# EAGLE design FINAL (EAGLE 9.6.2)
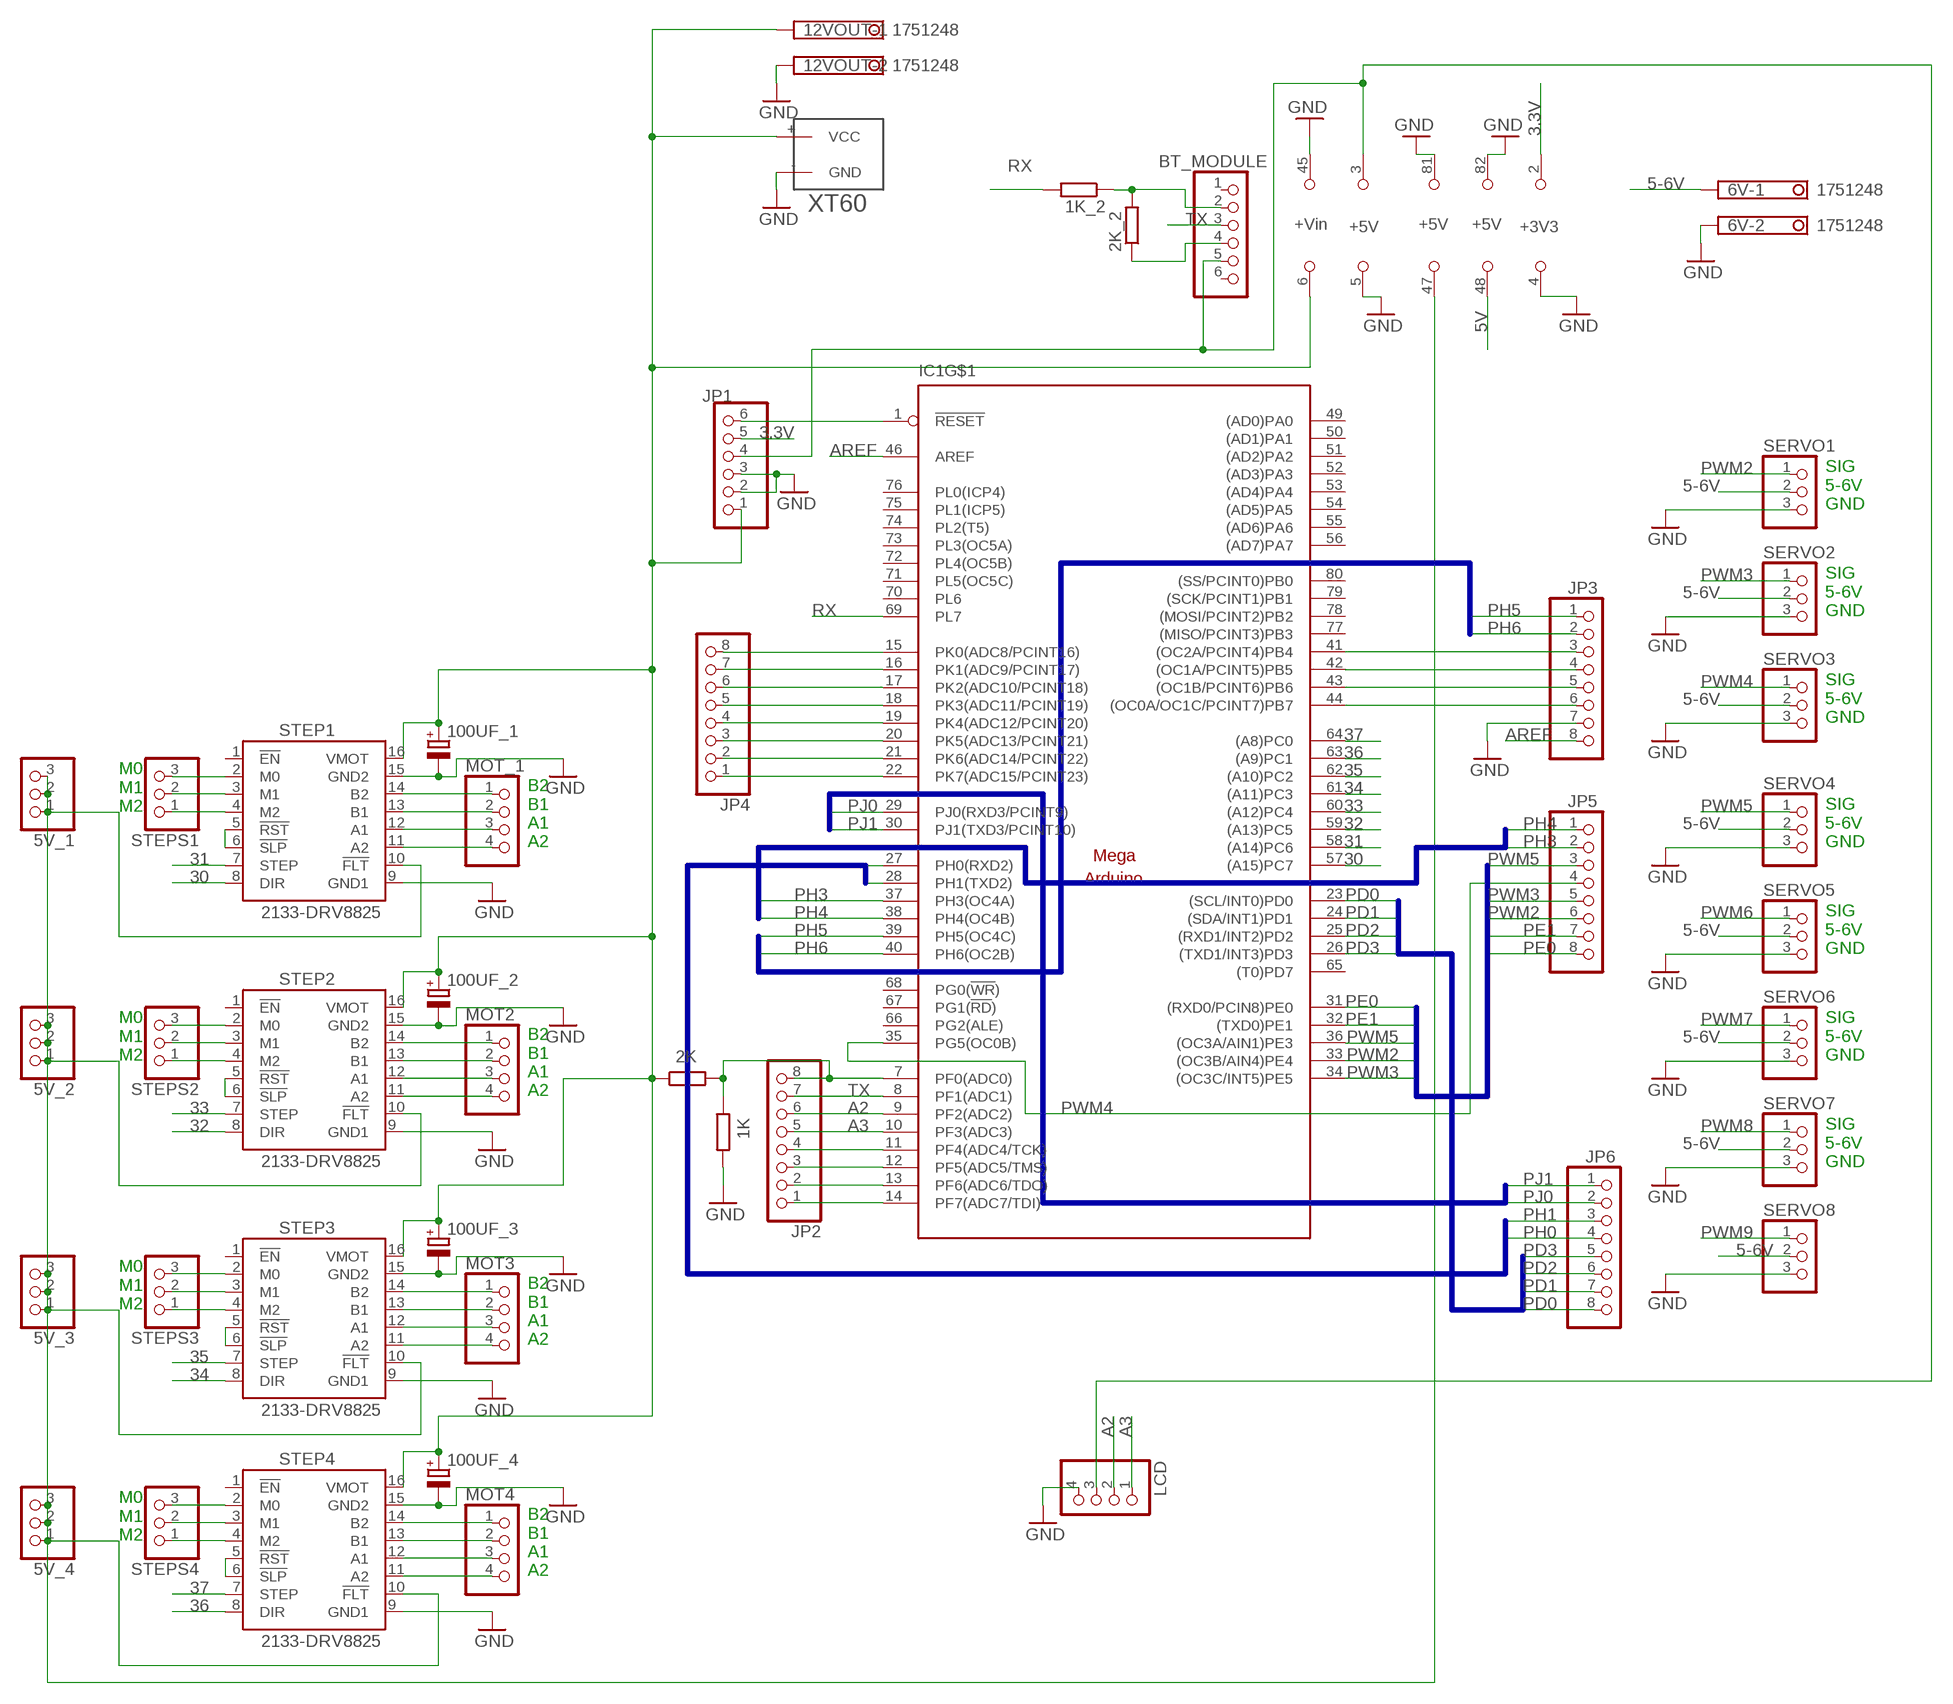
[diagram p0: schematic, sheet 1]

## Parts
1K  R-EU_0204/7  [0204/7]
1K_2  R-EU_0204/7  [0204/7]
2K  R-EU_0204/7  [0204/7]
2K_2  R-EU_0204/7  [0204/7]
5V_1  PINHD-1X3  [1X03]
5V_2  PINHD-1X3  [1X03]
5V_3  PINHD-1X3  [1X03]
5V_4  PINHD-1X3  [1X03]
6V  1751248  [1751248]
12VOUT  1751248  [1751248]
100UF_1  CPOL-EUE5-5  [E5-5]
100UF_2  CPOL-EUE5-5  [E5-5]
100UF_3  CPOL-EUE5-5  [E5-5]
100UF_4  CPOL-EUE5-5  [E5-5]
BT_MODULE  PINHD-1X6  [1X06]
IC1  MEGAARDUINO_22  [MEGA_ARDUINO_2]
JP1  PINHD-1X6  [1X06]
JP2  PINHD-1X8  [1X08]
JP3  PINHD-1X8  [1X08]
JP4  PINHD-1X8  [1X08]
JP5  PINHD-1X8  [1X08]
JP6  PINHD-1X8  [1X08]
LCD  PINHD-1X4  [1X04]
MOT2  PINHD-1X4  [1X04]
MOT3  PINHD-1X4  [1X04]
MOT4  PINHD-1X4  [1X04]
MOT_1  PINHD-1X4  [1X04]
SERVO1  PINHD-1X3  [1X03]
SERVO2  PINHD-1X3  [1X03]
SERVO3  PINHD-1X3  [1X03]
SERVO4  PINHD-1X3  [1X03]
SERVO5  PINHD-1X3  [1X03]
SERVO6  PINHD-1X3  [1X03]
SERVO7  PINHD-1X3  [1X03]
SERVO8  PINHD-1X3  [1X03]
STEP1  2133-DRV8825  [DRV8825]
STEP2  2133-DRV8825  [DRV8825]
STEP3  2133-DRV8825  [DRV8825]
STEP4  2133-DRV8825  [DRV8825]
STEPS1  PINHD-1X3  [1X03]
STEPS2  PINHD-1X3  [1X03]
STEPS3  PINHD-1X3  [1X03]
STEPS4  PINHD-1X3  [1X03]
U$1  XT60  [XT60]

## Nets
3.3V [ALL]: IC1.2(+3V3) JP1.5
5-6V [ALL]: 6V.1 SERVO1.2 SERVO2.2 SERVO3.2 SERVO4.2 SERVO5.2 SERVO6.2 SERVO7.2 SERVO8.2
5V [ALL]: IC1.48(+5V)
12V1 [12V]: 2K.1 12VOUT.1 100UF_1.+ 100UF_2.+ 100UF_3.+ 100UF_4.+ IC1.6(+VIN) JP1.1 STEP1.16(VMOT) STEP2.16(VMOT) STEP3.16(VMOT) STEP4.16(VMOT) U$1.+(VCC)
30 [ALL]: IC1.57((A15)PC7) STEP1.8(DIR)
31 [ALL]: IC1.58((A14)PC6) STEP1.7(STEP)
32 [ALL]: IC1.59((A13)PC5) STEP2.8(DIR)
33 [ALL]: IC1.60((A12)PC4) STEP2.7(STEP)
34 [ALL]: IC1.61((A11)PC3) STEP3.8(DIR)
35 [ALL]: IC1.62((A10)PC2) STEP3.7(STEP)
36 [ALL]: IC1.63((A9)PC1) STEP4.8(DIR)
37 [ALL]: IC1.64((A8)PC0) STEP4.7(STEP)
A2 [ALL]: IC1.9(PF2(ADC2)) JP2.6 LCD.2
A3 [ALL]: IC1.10(PF3(ADC3)) JP2.5 LCD.1
AREF [ALL]: IC1.46(AREF) JP3.8
GND [ALL]: 1K.2 6V.2 12VOUT.2 100UF_1.- 100UF_2.- 100UF_3.- 100UF_4.- IC1.4(GND) IC1.5(GND) IC1.45(GND) IC1.81(GND) IC1.82(GND) JP1.2 JP1.3 JP3.7 LCD.4 SERVO1.3 SERVO2.3 SERVO3.3 SERVO4.3 SERVO5.3 SERVO6.3 SERVO7.3 SERVO8.3 STEP1.9(GND1) STEP1.15(GND2) STEP2.9(GND1) STEP2.15(GND2) STEP3.9(GND1) STEP3.15(GND2) STEP4.9(GND1) STEP4.15(GND2) U$1.-(GND)
N$1 [ALL]: IC1.11(PF4(ADC4/TCK)) JP2.4
N$2 [ALL]: MOT_1.1 STEP1.14(B2)
N$3 [ALL]: MOT_1.2 STEP1.13(B1)
N$4 [ALL]: MOT_1.3 STEP1.12(A1)
N$5 [ALL]: MOT_1.4 STEP1.11(A2)
N$6 [ALL]: MOT2.1 STEP2.14(B2)
N$7 [ALL]: MOT2.2 STEP2.13(B1)
N$8 [ALL]: MOT2.3 STEP2.12(A1)
N$9 [ALL]: MOT2.4 STEP2.11(A2)
N$10 [ALL]: MOT3.1 STEP3.14(B2)
N$11 [ALL]: MOT3.2 STEP3.13(B1)
N$12 [ALL]: MOT3.3 STEP3.12(A1)
N$13 [ALL]: MOT3.4 STEP3.11(A2)
N$14 [ALL]: MOT4.1 STEP4.14(B2)
N$15 [ALL]: MOT4.2 STEP4.13(B1)
N$16 [ALL]: MOT4.3 STEP4.12(A1)
N$17 [ALL]: MOT4.4 STEP4.11(A2)
N$18 [ALL]: STEP1.2(M0) STEPS1.3
N$19 [ALL]: 2K_2.1 BT_MODULE.4
N$20 [ALL]: 1K_2.1 2K_2.2 BT_MODULE.2
N$22 [ALL]: STEP1.3(M1) STEPS1.2
N$23 [ALL]: STEP1.4(M2) STEPS1.1
N$24 [ALL]: STEP2.2(M0) STEPS2.3
N$25 [ALL]: STEP2.3(M1) STEPS2.2
N$26 [ALL]: STEP2.4(M2) STEPS2.1
N$27 [ALL]: STEP3.2(M0) STEPS3.3
N$28 [ALL]: STEP3.3(M1) STEPS3.2
N$29 [ALL]: STEP3.4(M2) STEPS3.1
N$30 [ALL]: STEP4.2(M0) STEPS4.3
N$31 [ALL]: STEP4.3(M1) STEPS4.2
N$32 [ALL]: STEP4.4(M2) STEPS4.1
N$33 [ALL]: STEP1.5(!RST) STEP1.6(!SLP)
N$34 [ALL]: STEP2.5(!RST) STEP2.6(!SLP)
N$35 [ALL]: STEP3.5(!RST) STEP3.6(!SLP)
N$36 [ALL]: STEP4.5(!RST) STEP4.6(!SLP)
N$37 [ALL]: 5V_1.1 5V_1.2 5V_1.3 5V_2.1 5V_2.2 5V_2.3 5V_3.1 5V_3.2 5V_3.3 5V_4.1 5V_4.2 5V_4.3 IC1.47(+5V) STEP1.10(!FLT) STEP2.10(!FLT) STEP3.10(!FLT) STEP4.10(!FLT)
N$38 [ALL]: IC1.1(!RESET) JP1.6
N$39 [ALL]: 1K.1 2K.2 IC1.7(PF0(ADC0)) JP2.8
N$40 [ALL]: IC1.12(PF5(ADC5/TMS)) JP2.3
N$41 [ALL]: IC1.13(PF6(ADC6/TDO)) JP2.2
N$42 [ALL]: IC1.14(PF7(ADC7/TDI)) JP2.1
N$43 [ALL]: IC1.15(PK0(ADC8/PCINT16)) JP4.8
N$44 [ALL]: IC1.16(PK1(ADC9/PCINT17)) JP4.7
N$45 [ALL]: IC1.17(PK2(ADC10/PCINT18)) JP4.6
N$46 [ALL]: IC1.18(PK3(ADC11/PCINT19)) JP4.5
N$47 [ALL]: IC1.19(PK4(ADC12/PCINT20)) JP4.4
N$48 [ALL]: IC1.20(PK5(ADC13/PCINT21)) JP4.3
N$49 [ALL]: IC1.21(PK6(ADC14/PCINT22)) JP4.2
N$50 [ALL]: IC1.22(PK7(ADC15/PCINT23)) JP4.1
N$51 [ALL]: IC1.44((OC0A/OC1C/PCINT7)PB7) JP3.6
N$52 [ALL]: IC1.43((OC1B/PCINT6)PB6) JP3.5
N$53 [ALL]: IC1.42((OC1A/PCINT5)PB5) JP3.4
N$54 [ALL]: IC1.41((OC2A/PCINT4)PB4) JP3.3
N$55 [ALL]: BT_MODULE.5 IC1.3(+5V) JP1.4 LCD.3
PD0 [ALL]: IC1.23((SCL/INT0)PD0) JP6.8
PD1 [ALL]: IC1.24((SDA/INT1)PD1) JP6.7
PD2 [ALL]: IC1.25((RXD1/INT2)PD2) JP6.6
PD3 [ALL]: IC1.26((TXD1/INT3)PD3) JP6.5
PE0 [ALL]: IC1.31((RXD0/PCIN8)PE0) JP5.8
PE1 [ALL]: IC1.32((TXD0)PE1) JP5.7
PH0 [ALL]: IC1.27(PH0(RXD2)) JP6.4
PH1 [ALL]: IC1.28(PH1(TXD2)) JP6.3
PH3 [ALL]: IC1.37(PH3(OC4A)) JP5.2
PH4 [ALL]: IC1.38(PH4(OC4B)) JP5.1
PH5 [ALL]: IC1.39(PH5(OC4C)) JP3.1
PH6 [ALL]: IC1.40(PH6(OC2B)) JP3.2
PJ0 [ALL]: IC1.29(PJ0(RXD3/PCINT9)) JP6.2
PJ1 [ALL]: IC1.30(PJ1(TXD3/PCINT10)) JP6.1
PWM2 [ALL]: IC1.33((OC3B/AIN4)PE4) JP5.6 SERVO1.1
PWM3 [ALL]: IC1.34((OC3C/INT5)PE5) JP5.5 SERVO2.1
PWM4 [ALL]: IC1.35(PG5(OC0B)) JP5.4 SERVO3.1
PWM5 [ALL]: IC1.36((OC3A/AIN1)PE3) JP5.3 SERVO4.1
PWM6 [ALL]: SERVO5.1
PWM7 [ALL]: SERVO6.1
PWM8 [ALL]: SERVO7.1
PWM9 [ALL]: SERVO8.1
RX [ALL]: 1K_2.2 IC1.69(PL7)
TX [ALL]: BT_MODULE.3 IC1.8(PF1(ADC1)) JP2.7
Unconnected: BT_MODULE.1 BT_MODULE.6 IC1.49((AD0)PA0) IC1.50((AD1)PA1) IC1.51((AD2)PA2) IC1.52((AD3)PA3) IC1.53((AD4)PA4) IC1.54((AD5)PA5) IC1.55((AD6)PA6) IC1.56((AD7)PA7) IC1.65((T0)PD7) IC1.66(PG2(ALE)) IC1.67(PG1(!RD!)) IC1.68(PG0(!WR!)) IC1.70(PL6) IC1.71(PL5(OC5C)) IC1.72(PL4(OC5B)) IC1.73(PL3(OC5A)) IC1.74(PL2(T5)) IC1.75(PL1(ICP5)) IC1.76(PL0(ICP4)) IC1.77((MISO/PCINT3)PB3) IC1.78((MOSI/PCINT2)PB2) IC1.79((SCK/PCINT1)PB1) IC1.80((SS/PCINT0)PB0) STEP1.1(!EN) STEP2.1(!EN) STEP3.1(!EN) STEP4.1(!EN)

## Buses
PH5,PH6
PH3,PH4
PE0,PE1,PWM2,PWM3,PWM5
PJ0,PJ1
PH0,PH1
PD0,PD1,PD2,PD3

## Notes on the sheet
- SIG
  5-6V
  GND
- SIG
  5-6V
  GND
- SIG
  5-6V
  GND
- M0
  M1
  M2
- B2
  B1
  A1
  A2
- SIG
  5-6V
  GND
- SIG
  5-6V
  GND
- M0
  M1
  M2
- SIG
  5-6V
  GND
- B2
  B1
  A1
  A2
- SIG
  5-6V
  GND
- M0
  M1
  M2
- B2
  B1
  A1
  A2
- M0
  M1
  M2
- B2
  B1
  A1
  A2

## Library data of the parts
1K 1K_2 2K 2K_2 = rcl:R-EU_: RESISTOR, European symbol; SPICEPREFIX: R
5V_1-5V_4 SERVO1-SERVO8 STEPS1-STEPS4 = pinhead:PINHD-1X3: PIN HEADER
6V 12VOUT = con-phoenix-350:1751248: MKDS 1/ 2-3,5 Printklemme Nennstrom: 10 A Bemessungsspannung: 160 V Raster: 3,5 mm Polzahl: 2 Montageart: Löten Anschlussart: Schraubanschluss Anschlussrichtung vom Leiter zur Platine: 0° Source: http://eshop.phoenixcontact.com .. 1751248.pdf; OC_FARNELL: unknown; OC_NEWARK: unknown
100UF_1-100UF_4 = rcl:CPOL-EU: POLARIZED CAPACITOR, European symbol; SPICEPREFIX: C
BT_MODULE JP1 = pinhead:PINHD-1X6: PIN HEADER
IC1 = arduino:MEGAARDUINO_2: The Arduino Mega is a microcontroller board based on the ATmega1280. - 54 digital input/output pins (of which 14 can be used as PWM outputs) - 16 analog inputs - 4 UARTs (hardware serial ports) - 16 MHz crystal oscillator - USB connection - power jack - ICSP header - reset button It contains everything needed to support the microcontroller; simply connect it to a computer with a USB cable or power it with a AC-to-DC adapter or battery to get started. The Mega is compatible with most shields designed for the Arduino Duemilanove or Diecimila. http://arduino.cc/en/Main/ArduinoBoardMega
JP2-JP6 = pinhead:PINHD-1X8: PIN HEADER
LCD MOT2-MOT4 MOT_1 = pinhead:PINHD-1X4: PIN HEADER
STEP1-STEP4 = pololu-stepper-driver:2133-DRV8825: DRV8825 Stepper Motor Driver Carrier, High Current #2133 DRV8825 Stepper Motor Driver Carrier; High Current <https://www.pololu.com/product/2133> in Japan, Suzaku Lab. Ltd. <https://suzakugiken.jp/> #2133 DRV8825 大電流用ステッピングモータドライバ <https://szc.jp/po2133>
U$1 = XT60:XT60: XT60

## Net classes
1 12V: width 1.27 mm, clearance 0.127 mm
2 ALL: width 0.508 mm, clearance 0.127 mm

## Board
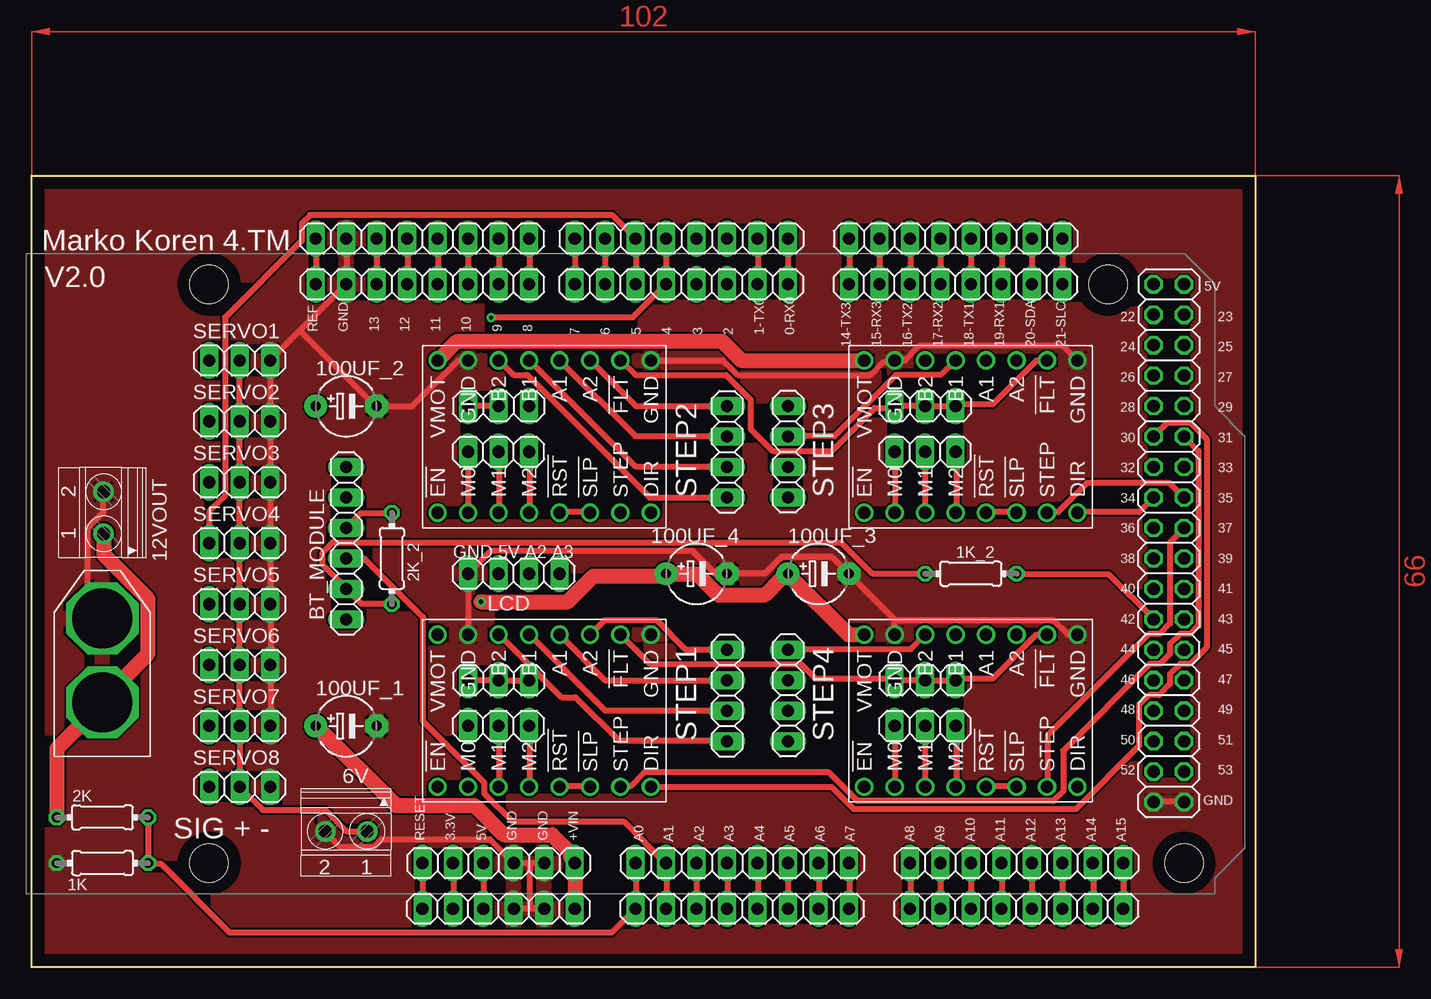
[diagram p1: board, top side]
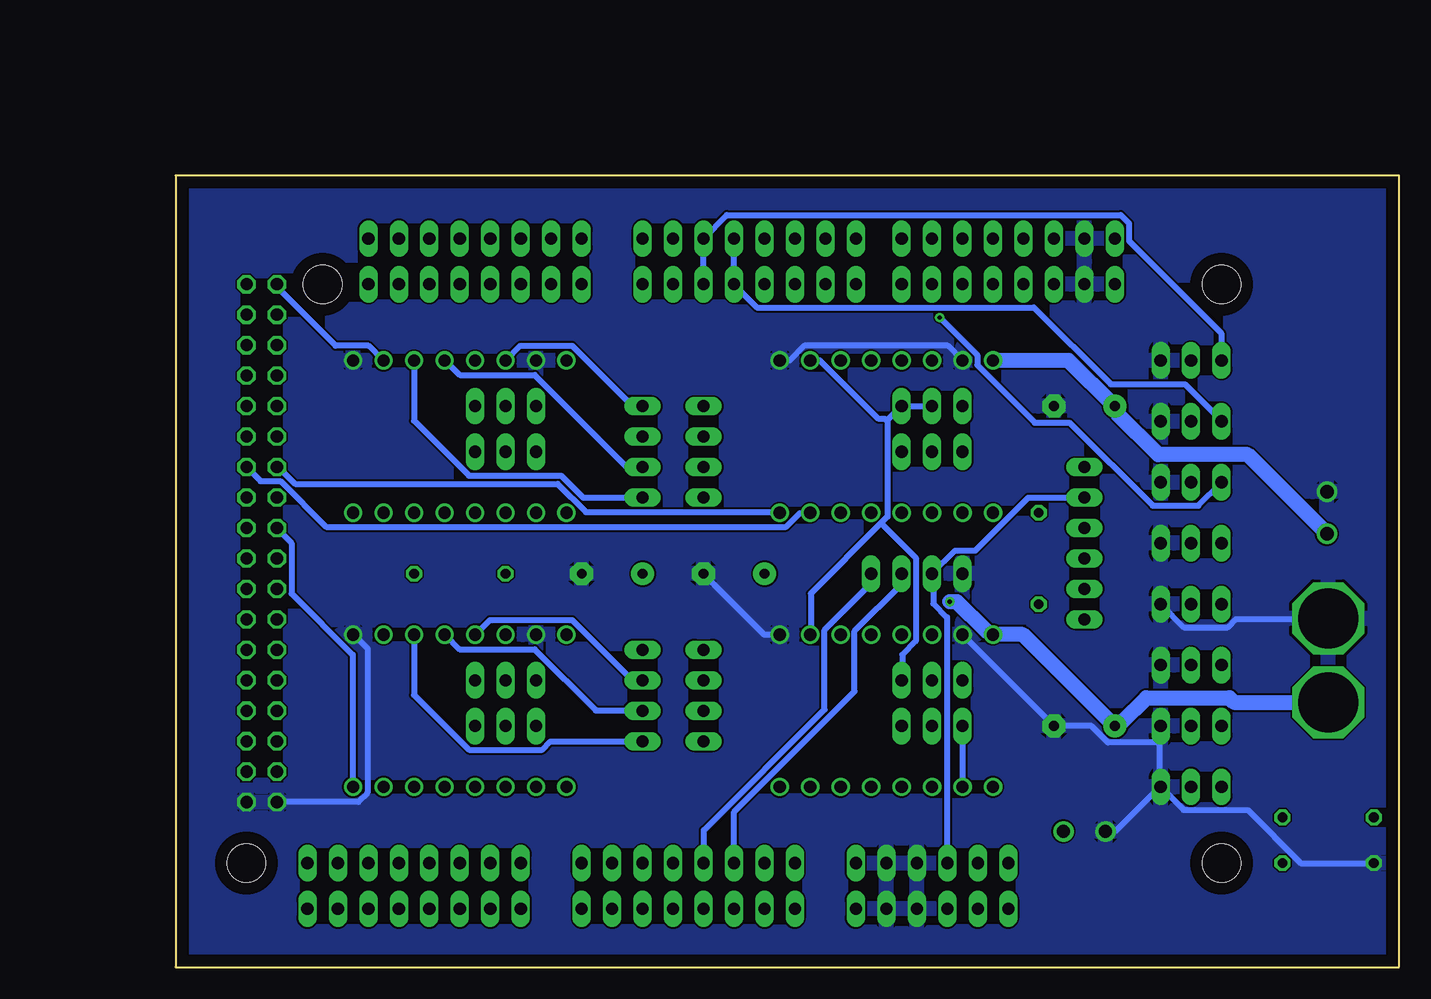
[diagram p2: board, bottom side, seen from below]

Size 102 x 66 mm. Coordinates in mm from the lower left corner, seen from the top.
Outline: 0,66 102,66 102,0 0,0 0,66
Copper layers (1*16): Top 0.035mm / dielectric 1.5mm / Bottom 0.035mm
Design rules "default": minimum track width 6mil, minimum drill 0.35mm, track to track 6mil, track to pad 6mil, pad to pad 6mil, via to via 6mil, smd to smd 6mil, copper to edge 40mil, drill to drill 6mil, minimum pad ring 10mil, minimum via ring 8mil, stop-mask expansion 4mil, vias tented up to drill 0mil, thermal gap 10mil

### Footprints (pad centres in the part's own frame; a part is rotated, then mirrored left to right if it is on the bottom)
0204/7 = drill 0.813 octagon: 1 -3.81,0; 2 3.81,0
1X03 = drill 1.016 long: 1 -2.54,0; 2 0,0; 3 2.54,0
1751248 = drill 1.1 pad 1.7: 1 -1.75,-0.1; 2 1.75,-0.1
E5-5 = drill 0.813 pad 1.905: + -2.54,0 | drill 0.813 pad 1.905 octagon: - 2.54,0
1X06 = drill 1.016 long: 1 -6.35,0; 2 -3.81,0; 3 -1.27,0; 4 1.27,0; 5 3.81,0; 6 6.35,0
MEGA_ARDUINO_2 = drill 1.016 long: 1 33.02,2.54; 2 35.56,2.54; 3 38.1,2.54; 4 40.64,2.54; 5 43.18,2.54; 6 45.72,2.54; 7 50.8,2.54; 8 53.34,2.54; 9 55.88,2.54; 10 58.42,2.54; 11 60.96,2.54; 12 63.5,2.54; 13 66.04,2.54; 14 68.58,2.54; 15 73.66,2.54; 16 76.2,2.54; 17 78.74,2.54; 18 81.28,2.54; 19 83.82,2.54; 20 86.36,2.54; 21 88.9,2.54; 22 91.44,2.54; 23 86.36,50.8; 24 83.82,50.8; 25 81.28,50.8; 26 78.74,50.8; 27 76.2,50.8; 28 73.66,50.8; 29 71.12,50.8; 30 68.58,50.8; 31 63.5,50.8; 32 60.96,50.8; 33 58.42,50.8; 34 55.88,50.8; 35 53.34,50.8; 36 50.8,50.8; 37 48.26,50.8; 38 45.72,50.8; 39 41.91,50.8; 40 39.37,50.8; 41 36.83,50.8; 42 34.29,50.8; 43 31.75,50.8; 44 29.21,50.8; 45 26.67,50.8; 46 24.13,50.8 | drill 1.016 octagon: 47 93.98,50.8; 48 96.52,50.8; 49 93.98,48.26; 50 96.52,48.26; 51 93.98,45.72; 52 96.52,45.72; 53 93.98,43.18; 54 96.52,43.18; 55 93.98,40.64; 56 96.52,40.64; 57 93.98,38.1; 58 96.52,38.1; 59 93.98,35.56; 60 96.52,35.56; 61 93.98,33.02; 62 96.52,33.02; 63 93.98,30.48; 64 96.52,30.48; 65 93.98,27.94; 66 96.52,27.94; 67 93.98,25.4; 68 96.52,25.4; 69 93.98,22.86; 70 96.52,22.86; 71 93.98,20.32; 72 96.52,20.32; 73 93.98,17.78; 74 96.52,17.78; 75 93.98,15.24; 76 96.52,15.24; 77 93.98,12.7; 78 96.52,12.7; 79 93.98,10.16; 80 96.52,10.16; 81 93.98,7.62; 82 96.52,7.62 | hole 3.2: 15.24,50.8; 15.24,2.54; 90.17,50.8; 96.52,2.54
1X08 = drill 1.016 long: 1 -8.89,0; 2 -6.35,0; 3 -3.81,0; 4 -1.27,0; 5 1.27,0; 6 3.81,0; 7 6.35,0; 8 8.89,0
1X04 = drill 1.016 long: 1 -3.81,0; 2 -1.27,0; 3 1.27,0; 4 3.81,0
DRV8825 = drill 1.016: 1 -6.35,8.89; 2 -6.35,6.35; 3 -6.35,3.81; 4 -6.35,1.27; 5 -6.35,-1.27; 6 -6.35,-3.81; 7 -6.35,-6.35; 8 -6.35,-8.89; 9 6.35,-8.89; 10 6.35,-6.35; 11 6.35,-3.81; 12 6.35,-1.27; 13 6.35,1.27; 14 6.35,3.81; 15 6.35,6.35; 16 6.35,8.89
XT60 = drill 5 octagon: + 4.5,0; - 11.5,0

### Placement (x,y rotation side)
1K  5.91,8.67 180 top
1K_2  78.3,32.8 0 top
2K  5.91,12.48 0 top
2K_2  30.04,34.07 270 top
5V_1  38.93,23.91 0 top
5V_2  74.49,23.91 0 top
5V_3  74.49,46.77 0 top
5V_4  38.93,46.77 0 top
6V  26.23,11.21 180 top
12VOUT  5.91,37.88 90 top
100UF_1  26.23,20.1 0 top
100UF_2  26.23,46.77 0 top
100UF_3  65.6,32.8 0 top
100UF_4  55.44,32.8 0 top
BT_MODULE  26.23,35.34 90 top
IC1  -0.44,6.13 0 top
JP1  38.93,4.86 180 top
JP2  59.25,4.86 180 top
JP3  32.58,60.74 180 top
JP4  82.11,4.86 180 top
JP5  54.17,60.74 0 top
JP6  77.03,60.74 0 top
LCD  40.2,32.8 180 top
MOT2  57.98,42.96 90 top
MOT3  63.06,42.96 270 top
MOT4  63.06,22.64 270 top
MOT_1  57.98,22.64 90 top
SERVO1  17.34,50.58 0 top
SERVO2  17.34,45.5 0 top
SERVO3  17.34,40.42 0 top
SERVO4  17.34,35.34 0 top
SERVO5  17.34,30.26 0 top
SERVO6  17.34,25.18 0 top
SERVO7  17.34,20.1 0 top
SERVO8  17.34,15.02 0 top
STEP1  42.74,21.37 90 top
STEP2  42.74,44.23 90 top
STEP3  78.3,44.23 90 top
STEP4  78.3,21.37 90 top
STEPS1  38.93,20.1 180 top
STEPS2  38.93,42.96 180 top
STEPS3  74.49,42.96 180 top
STEPS4  74.49,20.1 180 top
U$1  5.91,17.56 90 top

### Tracks (layer width: path | path; a pad name or v marks a point on that pad's centre or on a via)
3.3V
  Top 0.508: JP1.5 35.17,4.86 35.17,8.67 IC1.2
5-6V
  Top 0.508: SERVO1.2 SERVO2.2 SERVO3.2 SERVO4.2 SERVO5.2 SERVO6.2 SERVO7.2 SERVO8.2 17.49,14.84 19.24,13.09 24.5,13.09 26.26,11.34 27.93,11.34 6V.1
12V1  (via drill 0.35)
  Top 1.27: STEP3.16 59.17,50.58 57.57,52.18 35.48,52.18 33.88,50.58 STEP2.16 | 2K.1 2.1,18.2 5.91,22.01 U$1.+ 6.22,22.62 9.72,26.12 9.72,30.69 6.06,34.35 6.06,36.1 12VOUT.1 | STEP4.16 68.09,27.72 63.06,32.75 100UF_3.+ 62.53,32.44 61.08,31 57.27,31 55.52,32.75 52.92,32.75 100UF_4.+ 52.32,32.6 46.83,32.6 44.7,30.46 v37.46,30.46 | JP1.1 45.31,4.86 45.31,8.67 IC1.6 44.92,9.2 44.92,9.51 43.4,11.03 39.36,11.03 36.92,13.47 30.37,13.47 23.74,20.1 100UF_1.+
  Bottom 1.27: STEP2.16 27.55,50.58 23.74,46.77 100UF_2.+ 23.51,46.16 20.08,42.73 12.62,42.73 6.06,36.18 12VOUT.1 | v37.46,30.46 36.85,30.46 34.41,28.02 STEP1.16 31.36,27.72 23.74,20.1 100UF_1.+ 23.13,20.41 21.07,22.46 14.14,22.46 13.76,22.08 5.91,22.08 U$1.+
30
  Top 0.508: STEP1.8 51.63,14.99 66.72,14.99 68.55,13.17 87.06,13.17 92.32,18.42 92.32,21.85 93.16,22.69 94,22.69 94.91,23.6 94.91,24.44 95.75,25.28 96.59,25.28 97.96,26.65 97.96,44.03 96.59,45.4 94.68,45.4 93.54,44.26 IC1.57
31
  Top 0.508: IC1.58 97.27,43.04 97.27,28.48 96.59,27.8 95.75,27.8 94.91,26.96 94.91,26.12 94.07,25.28 93.24,25.28 86,18.04 86,14.69 85.16,13.85 68.85,13.85 66.49,16.21 51.1,16.21 49.95,15.07 49.11,15.07 STEP1.7
32
  Bottom 0.508: STEP2.8 51.63,37.93 67.78,37.93 70.15,40.29 92.02,40.29 93.39,41.66 93.54,41.66 IC1.59
33
  Bottom 0.508: IC1.60 94.91,40.52 93.24,40.52 89.42,36.71 51.1,36.71 49.95,37.85 49.11,37.85 STEP2.7
34
  Top 0.508: IC1.61 92.32,37.93 87.22,37.93 STEP3.8
35
  Top 0.508: STEP3.7 84.7,37.93 85.54,37.93 87.98,40.37 94.84,40.37 96.06,39.15 IC1.62
36
  Bottom 0.508: STEP4.8 87.22,15.07 87.22,26.04 92.32,31.15 92.32,35.34 93.54,36.56 IC1.63
37
  Top 0.508: STEP4.7 84.7,15.07 84.7,19.34 93.16,27.8 94.07,27.8 94.91,28.63 94.91,35.42 96.06,36.56 IC1.64
A2
  Top 0.508: IC1.9 JP2.6
  Bottom 0.508: IC1.9 55.44,12.94 45.38,23 45.38,28.02 41.5,31.91 41.5,32.75 LCD.2
A3
  Top 0.508: JP2.5 58.03,4.86 58.03,8.67 IC1.10
  Bottom 0.508: LCD.1 44.01,31.99 47.9,28.1 47.9,21.47 57.95,11.41 57.95,8.67 IC1.10
AREF
  Top 0.508: IC1.46 23.74,56.98 23.74,60.72 JP3.8
GND
  Top 0.508: IC1.81 93.54,13.77 96.06,13.77 IC1.82 | 71.9,28.94 71.9,29.02 68.17,32.75 100UF_3.- 67.94,32.98 66.72,34.2 62.53,34.2 61.16,32.83 58.03,32.83 100UF_4.- 57.73,32.83 56.96,32.83 55.06,34.73 38.3,34.73 36.54,32.98 LCD.4 STEP1.15 | 71.9,28.94 71.9,27.72 STEP4.15 | STEP4.9 86.38,27.72 85.16,28.94 71.9,28.94 | JP1.2 41.5,4.86 | 41.5,4.86 JP1.3 | IC1.5 41.5,8.67 | 41.5,8.67 IC1.4 38.22,10.65 29.15,10.65 28.54,10.04 25.72,10.04 24.5,11.26 6V.2 | 41.5,8.67 41.5,4.86 | STEP3.9 87.14,50.58 85.92,51.8 74.03,51.8 72.81,50.58 STEP3.15 71.75,50.43 70.98,50.43 69.92,49.36 58.87,49.36 57.65,50.58 STEP2.9 | STEP2.15 35.55,50.58 31.74,46.77 100UF_2.- 28.54,46.85 22.33,53.06 | 12VOUT.2 5.99,39.61 5.99,37.93 4.69,36.63 4.69,30.31 5.91,29.09 U$1.- | JP3.7 26.26,60.72 26.26,56.98 IC1.45 26.03,56.75 22.33,53.06 | 22.33,53.06 20.01,50.73 SERVO1.3 19.93,50.58 19.93,45.7 SERVO2.3 19.93,45.48 19.93,40.6 SERVO3.3 19.93,40.37 19.93,35.57 SERVO4.3 19.93,35.34 19.93,30.46 SERVO5.3 19.93,30.23 19.93,25.2 SERVO6.3 19.93,24.98 19.93,20.1 SERVO7.3
  Bottom 0.508: STEP1.9 52.92,27.72 57.95,32.75 100UF_4.- | IC1.81 93.54,13.77 86.76,13.77 86,14.54 86,26.58 87.14,27.72 STEP4.9 | 1K.2 8.2,8.67 12.62,13.09 17.95,13.09 SERVO8.3 | SERVO8.3 19.93,15.22 19.93,20.1 SERVO7.3 20.16,18.73 24.27,18.73 25.65,20.1 100UF_1.- STEP1.15 | 6V.2 24.43,11.34 23.66,11.34 20.08,14.92 SERVO8.3 | STEP2.9 50.79,50.58 49.57,51.8 37.61,51.8 STEP2.15 | SERVO5.3 17.95,28.33 14.29,28.33 13.61,29.02 5.91,29.02 U$1.-
  pour Top: -0.44,68.36 103.7,68.36 103.7,-1.49 -2.98,-1.49 -2.98,68.36
  pour Bottom: -2.98,68.36 103.7,68.36 103.7,-1.49 -2.98,-1.49
N$1
  Top 0.508: JP2.4 60.55,4.86 60.55,8.67 IC1.11
N$2
  Top 0.508: MOT_1.1 57.95,18.88 48.96,18.88 45.34,22.5 44.2,22.5 38.98,27.72 STEP1.14
N$3
  Top 0.508: MOT_1.2 57.95,21.4 47.82,21.4 41.5,27.72 STEP1.13
N$4
  Top 0.508: MOT_1.3 47.82,23.91 STEP1.12
N$5
  Top 0.508: MOT_1.4 57.95,26.5 54.53,26.5 52.09,28.94 47.82,28.94 46.6,27.72 STEP1.11
N$6
  Top 0.508: MOT2.1 51.55,39.15 41.34,49.36 40.2,49.36 38.98,50.58 STEP2.14
N$7
  Top 0.508: MOT2.2 57.95,41.74 50.33,41.74 41.5,50.58 STEP2.13
N$8
  Top 0.508: STEP2.12 50.33,44.26 57.95,44.26 MOT2.3
N$9
  Top 0.508: MOT2.4 50.41,46.77 46.6,50.58 STEP2.11
N$10
  Bottom 0.508: MOT3.1 63.9,46.77 68.93,51.8 73.27,51.8 STEP3.14
N$11
  Top 0.508: MOT3.2 63.06,44.26 66.95,44.26 72.05,49.36 75.78,49.36 77,50.58 STEP3.13
N$12
  Bottom 0.508: MOT3.3 63.06,41.74 64.43,41.74 72.05,49.36 78.3,49.36 79.52,50.58 STEP3.12
N$13
  Bottom 0.508: MOT3.4 68.01,39.15 69.84,40.98 77.54,40.98 82.11,45.55 STEP3.11
N$14
  Top 0.508: STEP4.14 73.27,26.5 63.06,26.5 MOT4.1
N$15
  Bottom 0.508: MOT4.2 63.9,23.91 68.93,28.94 75.78,28.94 77,27.72 STEP4.13
N$16
  Bottom 0.508: MOT4.3 63.06,21.4 66.95,21.4 72.05,26.5 78.3,26.5 79.52,27.72 STEP4.12
N$17
  Bottom 0.508: STEP4.11 82.11,22.69 77.54,18.12 71.44,18.12 70.76,18.8 63.06,18.8 MOT4.4
N$18
  Bottom 0.508: STEPS1.3 STEP1.2
N$19
  Top 0.508: BT_MODULE.4 27.48,37.85 29.99,37.85 2K_2.1
N$20
  Top 0.508: 2K_2.2 29.99,30.31 27.48,30.31 26.26,31.53 BT_MODULE.2 26.1,31.76 24.27,33.59 24.27,34.58 25.11,35.42 67.48,35.42 70.07,32.83 74.49,32.83 1K_2.1
N$22
  Top 0.508: STEP1.3 38.98,15.07 38.98,20.1 STEPS1.2
N$23
  Top 0.508: STEP1.4 41.5,15.07 41.5,20.1 STEPS1.1
N$24
  Top 0.508: STEPS2.3 STEP2.2
N$25
  Top 0.508: STEP2.3 38.98,37.93 38.98,42.96 STEPS2.2
N$26
  Top 0.508: STEP2.4 41.5,37.93 41.5,42.96 STEPS2.1
N$27
  Top 0.508: STEP3.2 71.97,37.93 71.97,42.96 STEPS3.3
N$28
  Top 0.508: STEPS3.2 STEP3.3
N$29
  Top 0.508: STEP3.4 77.08,37.93 77.08,42.96 STEPS3.1
N$30
  Top 0.508: STEP4.2 71.97,15.07 71.97,20.1 STEPS4.3
N$31
  Top 0.508: STEPS4.2 STEP4.3
N$32
  Top 0.508: STEP4.4 77.08,15.07 77.08,20.1 STEPS4.1
N$33
  Top 0.508: STEP1.5 44.01,15.07 46.53,15.07 STEP1.6
N$34
  Top 0.508: STEP2.5 44.01,37.93 46.53,37.93 STEP2.6
N$35
  Top 0.508: STEP3.5 79.59,37.93 82.11,37.93 STEP3.6
N$36
  Top 0.508: STEP4.5 79.59,15.07 82.11,15.07 STEP4.6
N$37
  Top 0.508: STEP3.10 83.79,50.58 80.13,46.92 77.23,46.92 5V_3.3 5V_3.2 5V_3.1 71.75,46.62 70.3,46.62 66.72,43.04 61.77,43.04 59.94,44.87 59.94,47.3 57.88,49.36 50.33,49.36 49.11,50.58 STEP2.10 | STEP4.10 83.79,27.72 80.13,24.06 77.23,24.06 5V_2.3 5V_2.2 5V_2.1 71.75,24.06 65.35,24.06 64.13,25.28 51.55,25.28 49.11,27.72 STEP1.10 | 5V_1.1 5V_1.2 5V_1.3 | 5V_4.2 5V_4.1
  Bottom 0.508: IC1.47 93.54,56.68 88.66,51.8 85.92,51.8 84.7,50.58 STEP3.10 | 43.17,37.02 42.64,37.55 42.64,45.63 | 43.17,37.02 49.04,31.15 49.04,27.72 STEP1.10 | 42.64,45.63 41.5,46.77 5V_4.3 5V_4.2 | STEP2.10 48.28,50.58 43.4,45.7 42.87,45.7 42.64,45.63 | 43.17,37.02 40.28,34.12 40.28,27.19 41.42,26.04 41.42,23.91 5V_1.3
N$38
  Top 0.508: IC1.1 JP1.6
N$39
  Top 0.508: 2K.2 1K.1 9.95,8.59 10.79,8.59 16.5,2.88 48.35,2.88 50.18,4.71 JP2.8 50.41,4.86 50.41,8.67 IC1.7
N$40
  Top 0.508: IC1.12 JP2.3
N$41
  Top 0.508: JP2.2 65.65,4.86 65.65,8.67 IC1.13
N$42
  Top 0.508: JP2.1 68.17,4.86 68.17,8.67 IC1.14
N$43
  Top 0.508: JP4.8 73.27,4.86 73.27,8.67 IC1.15
N$44
  Top 0.508: JP4.7 75.78,4.86 75.78,8.67 IC1.16
N$45
  Top 0.508: IC1.17 JP4.6
N$46
  Top 0.508: JP4.5 80.89,4.86 80.89,8.67 IC1.18
N$47
  Top 0.508: JP4.4 83.41,4.86 83.41,8.67 IC1.19
N$48
  Top 0.508: IC1.20 JP4.3
N$49
  Top 0.508: JP4.2 88.51,4.86 88.51,8.67 IC1.21
N$50
  Top 0.508: JP4.1 91.03,4.86 91.03,8.67 IC1.22
N$51
  Top 0.508: JP3.6 IC1.44
N$52
  Top 0.508: IC1.43 31.36,56.98 31.36,60.72 JP3.5
N$53
  Top 0.508: IC1.42 33.88,56.98 33.88,60.72 JP3.4
N$54
  Top 0.508: JP3.3 IC1.41
N$55
  Top 0.508: JP1.4 37.69,4.86 37.69,8.67 IC1.3
  Bottom 0.508: BT_MODULE.5 30.9,39.15 35.32,34.73 37,34.73 LCD.3 38.83,32.6 38.83,30.31 37.69,29.17 37.69,8.67 IC1.3
PD0
  Top 0.508: JP6.8 IC1.23
PD1
  Top 0.508: IC1.24 83.41,56.98 83.41,60.72 JP6.7
PD2
  Top 0.508: IC1.25 80.89,56.98 80.89,60.72 JP6.6
PD3
  Top 0.508: JP6.5 IC1.26
PE0
  Top 0.508: JP5.8 IC1.31
PE1
  Top 0.508: IC1.32 60.55,56.98 60.55,60.72 JP5.7
PH0
  Top 0.508: IC1.27 75.78,56.98 75.78,60.72 JP6.4
PH1
  Top 0.508: IC1.28 73.27,56.98 73.27,60.72 JP6.3
PH3
  Top 0.508: JP5.2 IC1.37
PH4
  Top 0.508: IC1.38 45.31,56.98 45.31,60.72 JP5.1
PH5
  Top 0.508: IC1.39 41.5,56.98 41.5,60.72 JP3.1
PH6
  Top 0.508: IC1.40 38.98,56.98 38.98,60.72 JP3.2
PJ0
  Top 0.508: JP6.2 IC1.29
PJ1
  Top 0.508: IC1.30 68.17,56.98 68.17,60.72 JP6.1
PWM2
  Bottom 0.508: SERVO1.1 14.83,50.58 14.83,52.87 22.52,60.56 22.52,62.01 23.21,62.7 56.05,62.7 57.95,60.79 JP5.6 58.03,60.49 58.03,56.98 IC1.33
PWM3
  Bottom 0.508: SERVO2.1 14.83,45.55 17.87,48.6 24.05,48.6 30.45,55 53.53,55 55.44,56.91 IC1.34 JP5.5
PWM4  (via drill 0.35)
  Top 0.508: v38.3,54.16 50.11,54.16 52.85,56.91 IC1.35 52.92,57.13 52.92,60.72 JP5.4
  Bottom 0.508: v38.3,54.16 35.17,51.04 35.17,50.2 30.37,45.4 27.48,45.4 20.54,38.46 16.73,38.46 14.83,40.37 SERVO3.1
PWM5
  Top 0.508: SERVO4.1 14.83,35.34 14.83,38.01 16.12,39.3 16.12,54.16 22.52,60.56 22.52,62.01 23.21,62.7 48.43,62.7 50.33,60.79 JP5.3 50.41,60.49 50.41,56.98 IC1.36
RX
  Top 0.508: 1K_2.2 82.11,32.75 89.81,32.75 93.54,29.02 IC1.69
TX
  Top 0.508: BT_MODULE.3 26.26,34.05 27.78,34.05 32.66,29.17 32.66,20.48 37.76,15.38 37.76,14.46 40.12,12.1 49.42,12.1 52.85,8.67 IC1.8 52.92,8.44 52.92,4.86 JP2.7
(copper drawn outside any net)
  shapes: Top area x2

### Text on the board
tPlace: SIG + -
tNames: Marko Koren 4.TM | V2.0 | 5V | 22 / 24 / 26 / 28 / 30 / 32 / 34 / 36 / 38 / 40 / 42 / 44 / 46 / 48 / 50 / 52 | 23 / 25 / 27 / 29 / 31 / 33 / 35 / 37 / 39 / 41 / 43 / 45 / 47 / 49 / 51 / 53 / GND | REF / GND / 13 / 12 / 11 / 10 / 9 / 8 | 7 / 6 / 5 / 4 / 3 / 2 / 1-TX0 / 0-RX0 | 14-TX3 / 15-RX3 / 16-TX2 / 17-RX2 / 18-TX1 / 19-RX1 / 20-SDA / 21-SLC | GND 5V A2 A3 | RESET / 3.3V / 5V / GND / GND / +VIN | A0 / A1 / A2 / A3 / A4 / A5 / A6 / A7 | A8 / A9 / A10 / A11 / A12 / A13 / A14 / A15